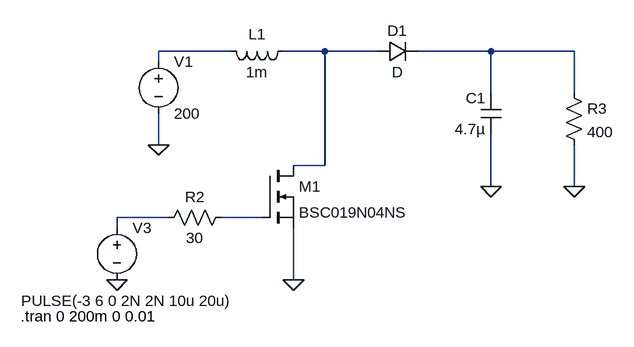
[diagram p0: schematic IdealMosfet.asc]
IdealMosfet.asc, the LTspice schematic file:
Version 4
SHEET 1 880 680
WIRE -608 -336 -720 -336
WIRE -464 -336 -528 -336
WIRE -384 -336 -464 -336
WIRE -208 -336 -320 -336
WIRE -80 -336 -208 -336
WIRE -720 -320 -720 -336
WIRE -208 -272 -208 -336
WIRE -80 -272 -80 -336
WIRE -720 -192 -720 -240
WIRE -464 -160 -464 -336
WIRE -464 -160 -512 -160
WIRE -208 -128 -208 -208
WIRE -80 -128 -80 -192
WIRE -704 -80 -784 -80
WIRE -560 -80 -624 -80
WIRE -784 -64 -784 -80
WIRE -512 16 -512 -64
FLAG -720 -192 0
FLAG -512 16 0
FLAG -784 16 0
FLAG -208 -128 0
FLAG -80 -128 0
SYMBOL voltage -720 -336 R0
WINDOW 123 0 0 Left 0
WINDOW 39 0 0 Left 0
SYMATTR InstName V1
SYMATTR Value 200
SYMBOL ind -512 -352 R90
WINDOW 0 5 56 VBottom 2
WINDOW 3 32 56 VTop 2
SYMATTR InstName L1
SYMATTR Value 1m
SYMBOL res -608 -96 R90
WINDOW 0 0 56 VBottom 2
WINDOW 3 32 56 VTop 2
SYMATTR InstName R2
SYMATTR Value 30
SYMBOL voltage -784 -80 R0
WINDOW 3 -147 128 Left 2
WINDOW 123 0 0 Left 0
WINDOW 39 0 0 Left 0
SYMATTR InstName V3
SYMATTR Value PULSE(-3 6 0 2N 2N 10u 20u)
SYMBOL diode -384 -352 M90
WINDOW 0 0 32 VBottom 2
WINDOW 3 32 32 VTop 2
SYMATTR InstName D1
SYMBOL res -96 -288 R0
SYMATTR InstName R3
SYMATTR Value 400
SYMBOL cap -192 -208 R180
WINDOW 0 24 56 Left 2
WINDOW 3 24 8 Left 2
SYMATTR InstName C1
SYMATTR Value 4.7µ
SYMBOL nmos -560 -160 R0
SYMATTR InstName M1
SYMATTR Value BSC019N04NS
TEXT -932 72 Left 2 !.tran 0 200m 0 0.01

The netlist it stands for:
* IdealMosfet.asc
V1 N001 0 200
L1 N002 N001 1m
R2 N005 N004 30
V3 N004 0 PULSE(-3 6 0 2N 2N 10u 20u)
D1 N002 N003 D
R3 N003 0 400
C1 0 N003 4.7µ
M1 N002 N005 0 0 BSC019N04NS
.model D D
.lib standard.dio
.model NMOS NMOS
.model PMOS PMOS
.lib standard.mos
.tran 0 200m 0 0.01
.backanno
.end